# Altium schematic sheet DigitalInterface2.SchDoc: Digital Interface
size A4; DrawnBy: Zheng; DocumentNumber: 3; Revision: 3; SheetNumber: 3; SheetTotal: 4
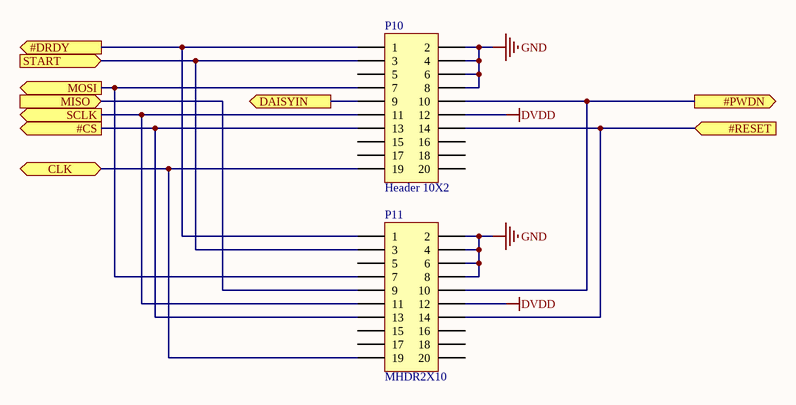
[diagram p0: DigitalInterface2.SchDoc]

## Parts
P10  Header 10X2  [61002021121]
P11  MHDR2X10  [HDR2.54-M-LS-2x10P]

## Ports
#CS (out), #DRDY (out), #PWDN (out), #RESET (in), CLK (bidir), DAISYIN (out), MISO (in), MOSI (out), SCLK (out), START (in)

## Nets
DVDD: P10.12 P11.12
GND: P10.2 P10.4 P10.6 P10.8 P11.2 P11.4 P11.6 P11.8
#CS: P10.13 P11.13 ; port #CS
#DRDY: P10.1 P11.1 ; port #DRDY
#PWDN: P10.10 P11.10 ; port #PWDN
#RESET: P10.14 P11.14 ; port #RESET
CLK: P10.19 P11.19 ; port CLK
DAISYIN: P10.9 ; port DAISYIN
MISO: P11.9 ; port MISO
MOSI: P10.7 P11.7 ; port MOSI
SCLK: P10.11 P11.11 ; port SCLK
START: P10.3 P11.3 ; port START

Not connected (* = marked no-connect by the designer): P10 5 15 16 17 18 20; P11 5 15 16 17 18 20

## Library data of the parts
P10 = Header 10X2: Header, 10-Pin, Dual row; LatestRevisionDate: 17-Jul-2002; LatestRevisionNote: Re-released for DXP Platform.; Publisher: Altium Limited
P11 = MHDR2X10: Header, 10-Pin, Dual row; LatestRevisionDate: 17-Jul-2002; LatestRevisionNote: Re-released for DXP Platform.; Publisher: Altium Limited